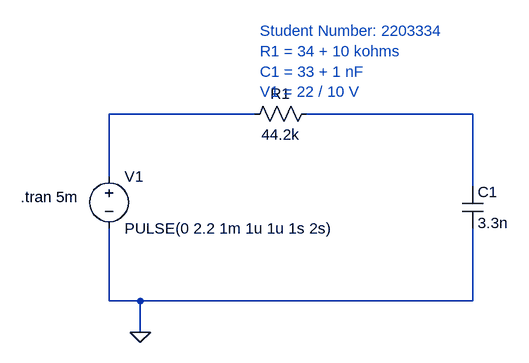
[diagram p0: schematic Lab3 - Step Response of RC Circuit.asc]
Lab3 - Step Response of RC Circuit.asc, the LTspice schematic file:
Version 4
SHEET 1 880 680
WIRE -176 -240 -400 -240
WIRE 160 -240 -96 -240
WIRE -400 -144 -400 -240
WIRE 160 -128 160 -240
WIRE -400 48 -400 -64
WIRE -352 48 -400 48
WIRE 160 48 160 -64
WIRE 160 48 -352 48
WIRE -352 96 -352 48
FLAG -352 96 0
SYMBOL res -80 -256 R90
WINDOW 0 0 56 VBottom 2
WINDOW 3 32 56 VTop 2
SYMATTR InstName R1
SYMATTR Value 44.2k
SYMBOL cap 144 -128 R0
SYMATTR InstName C1
SYMATTR Value 3.3n
SYMATTR SpiceLine Lser=0 mfg="   ---" pn="   ---" type="   ---"
SYMBOL voltage -400 -160 R0
SYMATTR InstName V1
SYMATTR Value PULSE(0 2.2 1m 1u 1u 1s 2s)
TEXT -168 -368 Left 2 ;Student Number: 2203334\nR1 = 34 + 10 kohms\nC1 = 33 + 1 nF\nV1 = 22 / 10 V
TEXT -536 -112 Left 2 !.tran 5m

The netlist it stands for:
* Lab3 - Step Response of RC Circuit.asc
R1 N002 N001 44.2k
C1 N002 0 3.3n Lser=0 mfg="   ---" pn="   ---" type="   ---"
V1 N001 0 PULSE(0 2.2 1m 1u 1u 1s 2s)
* Student Number: 2203334
* R1 = 34 + 10 kohms
* C1 = 33 + 1 nF
* V1 = 22 / 10 V
.tran 5m
.backanno
.end